# EAGLE design SnowFlake (EAGLE 8.5.1)
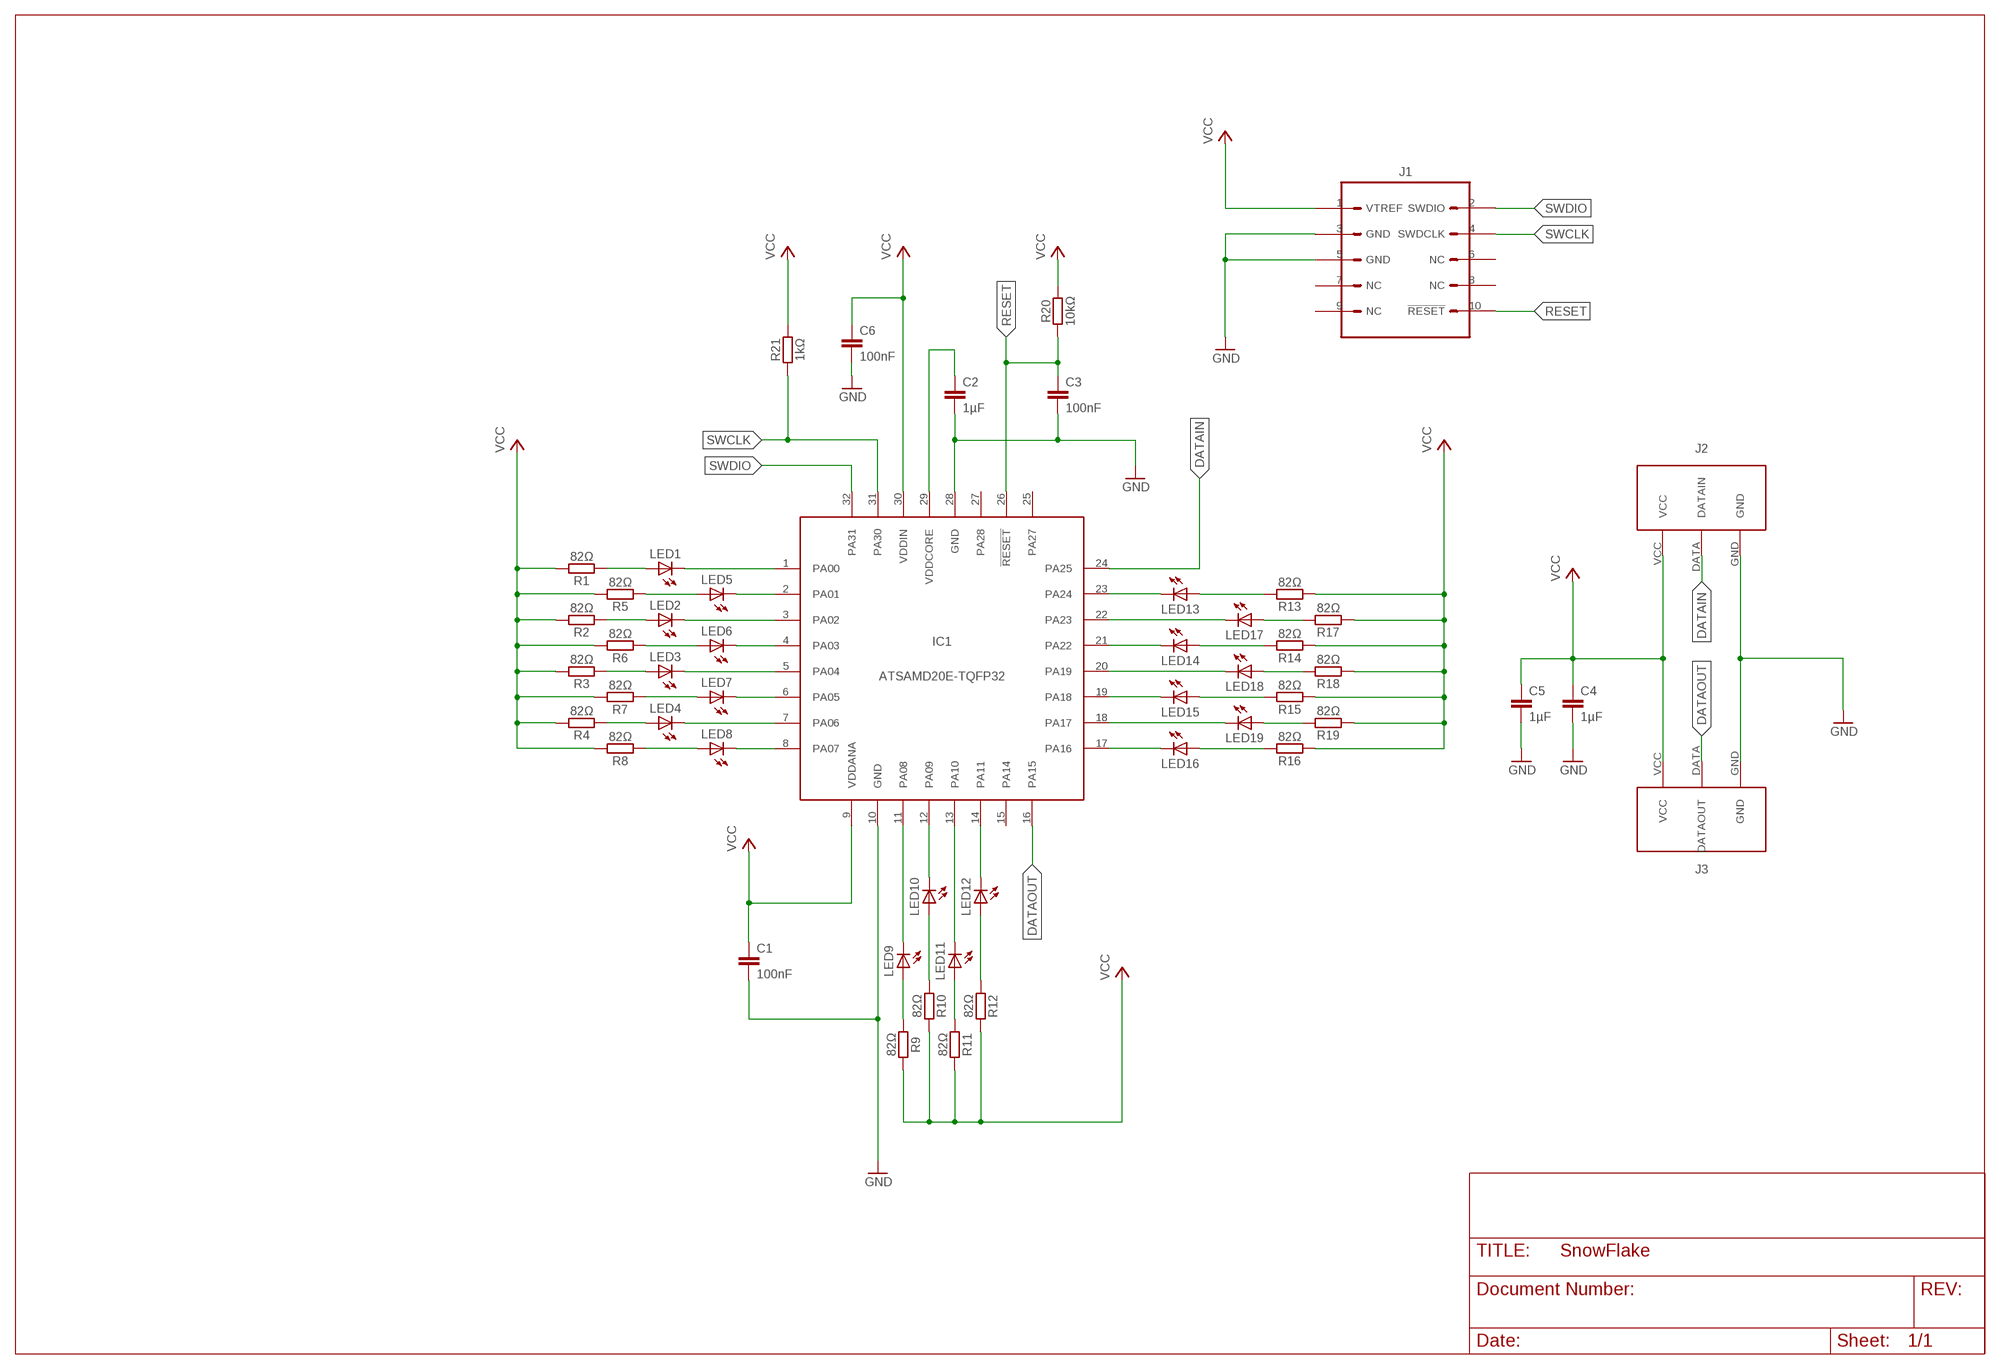
[diagram p0: schematic, sheet 1]

## Parts
C1  100nF  C0805-MURATA-GRM-21  [CAPACITOR-0805-MURATA-GRM-21]
C2  1µF  C0805-MURATA-GRM-21  [CAPACITOR-0805-MURATA-GRM-21]
C3  100nF  C0805-MURATA-GRM-21  [CAPACITOR-0805-MURATA-GRM-21]
C4  1µF  C0805-MURATA-GRM-21  [CAPACITOR-0805-MURATA-GRM-21]
C5  1µF  C0805-MURATA-GRM-21  [CAPACITOR-0805-MURATA-GRM-21]
C6  100nF  C0805-MURATA-GRM-21  [CAPACITOR-0805-MURATA-GRM-21]
IC1  ATSAMD20E-TQFP32  [TQFP32-08]
J1  CON-CORTEX-DEBUG-SMD1.27  [CON-2X5-HARWIN-1.27]
J2  CON-SNOWF-IN  [CON-PADS-3XWIRE-B]
J3  CON-SNOWF-OUT  [CON-PADS-3XWIRE-T]
LED1  LED0402  [LED-0402-ROHM]
LED2  LED0402  [LED-0402-ROHM]
LED3  LED0402  [LED-0402-ROHM]
LED4  LED0402  [LED-0402-ROHM]
LED5  LED0402  [LED-0402-ROHM]
LED6  LED0402  [LED-0402-ROHM]
LED7  LED0402  [LED-0402-ROHM]
LED8  LED0402  [LED-0402-ROHM]
LED9  LED0402  [LED-0402-ROHM]
LED10  LED0402  [LED-0402-ROHM]
LED11  LED0402  [LED-0402-ROHM]
LED12  LED0402  [LED-0402-ROHM]
LED13  LED0402  [LED-0402-ROHM]
LED14  LED0402  [LED-0402-ROHM]
LED15  LED0402  [LED-0402-ROHM]
LED16  LED0402  [LED-0402-ROHM]
LED17  LED0402  [LED-0402-ROHM]
LED18  LED0402  [LED-0402-ROHM]
LED19  LED0402  [LED-0402-ROHM]
R1  82Ω  RESISTOR0805-KOA-RK73-2A  [RESISTOR-0805-KOA-RK73-2A]
R2  82Ω  RESISTOR0805-KOA-RK73-2A  [RESISTOR-0805-KOA-RK73-2A]
R3  82Ω  RESISTOR0805-KOA-RK73-2A  [RESISTOR-0805-KOA-RK73-2A]
R4  82Ω  RESISTOR0805-KOA-RK73-2A  [RESISTOR-0805-KOA-RK73-2A]
R5  82Ω  RESISTOR0805-KOA-RK73-2A  [RESISTOR-0805-KOA-RK73-2A]
R6  82Ω  RESISTOR0805-KOA-RK73-2A  [RESISTOR-0805-KOA-RK73-2A]
R7  82Ω  RESISTOR0805-KOA-RK73-2A  [RESISTOR-0805-KOA-RK73-2A]
R8  82Ω  RESISTOR0805-KOA-RK73-2A  [RESISTOR-0805-KOA-RK73-2A]
R9  82Ω  RESISTOR0805-KOA-RK73-2A  [RESISTOR-0805-KOA-RK73-2A]
R10  82Ω  RESISTOR0805-KOA-RK73-2A  [RESISTOR-0805-KOA-RK73-2A]
R11  82Ω  RESISTOR0805-KOA-RK73-2A  [RESISTOR-0805-KOA-RK73-2A]
R12  82Ω  RESISTOR0805-KOA-RK73-2A  [RESISTOR-0805-KOA-RK73-2A]
R13  82Ω  RESISTOR0805-KOA-RK73-2A  [RESISTOR-0805-KOA-RK73-2A]
R14  82Ω  RESISTOR0805-KOA-RK73-2A  [RESISTOR-0805-KOA-RK73-2A]
R15  82Ω  RESISTOR0805-KOA-RK73-2A  [RESISTOR-0805-KOA-RK73-2A]
R16  82Ω  RESISTOR0805-KOA-RK73-2A  [RESISTOR-0805-KOA-RK73-2A]
R17  82Ω  RESISTOR0805-KOA-RK73-2A  [RESISTOR-0805-KOA-RK73-2A]
R18  82Ω  RESISTOR0805-KOA-RK73-2A  [RESISTOR-0805-KOA-RK73-2A]
R19  82Ω  RESISTOR0805-KOA-RK73-2A  [RESISTOR-0805-KOA-RK73-2A]
R20  10kΩ  RESISTOR0805-KOA-RK73-2A  [RESISTOR-0805-KOA-RK73-2A]
R21  1kΩ  RESISTOR0805-KOA-RK73-2A  [RESISTOR-0805-KOA-RK73-2A]

## Nets
DATAIN: IC1.24(PA25) J2.DATA(DATAIN)
DATAOUT: IC1.16(PA15) J3.DATA(DATAOUT)
GND: C1.2 C2.2 C3.2 C4.2 C5.2 C6.2 IC1.10(GND) IC1.28(GND) J1.3(GND) J1.5(GND) J2.GND J3.GND
LED1P: LED1.A R1.1
LED1S: IC1.1(PA00) LED1.C
LED2P: LED2.A R2.1
LED2S: IC1.3(PA02) LED2.C
LED3P: LED3.A R3.1
LED3S: IC1.5(PA04) LED3.C
LED4P: LED4.A R4.1
LED4S: IC1.7(PA06) LED4.C
LED5P: LED5.A R5.1
LED5S: IC1.2(PA01) LED5.C
LED6P: LED6.A R6.1
LED6S: IC1.4(PA03) LED6.C
LED7P: LED7.A R7.1
LED7S: IC1.6(PA05) LED7.C
LED8P: LED8.A R8.1
LED8S: IC1.8(PA07) LED8.C
LED9P: LED9.A R9.1
LED9S: IC1.11(PA08) LED9.C
LED10P: LED10.A R10.1
LED10S: IC1.12(PA09) LED10.C
LED11P: LED11.A R11.1
LED11S: IC1.13(PA10) LED11.C
LED12P: LED12.A R12.1
LED12S: IC1.14(PA11) LED12.C
LED13P: LED13.A R13.2
LED13S: IC1.23(PA24) LED13.C
LED14P: LED14.A R14.2
LED14S: IC1.21(PA22) LED14.C
LED15P: LED15.A R15.2
LED15S: IC1.19(PA18) LED15.C
LED16P: LED16.A R16.2
LED16S: IC1.17(PA16) LED16.C
LED17P: LED17.A R17.2
LED17S: IC1.22(PA23) LED17.C
LED18P: LED18.A R18.2
LED18S: IC1.20(PA19) LED18.C
LED19P: LED19.A R19.2
LED19S: IC1.18(PA17) LED19.C
RESET: C3.1 IC1.26(!RESET) J1.10(!RESET) R20.1
SWCLK: IC1.31(PA30) J1.4(SWDCLK) R21.1
SWDIO: IC1.32(PA31) J1.2(SWDIO)
VCC: C1.1 C4.1 C5.1 C6.1 IC1.9(VDDANA) IC1.30(VDDIN) J1.1(VTREF) J2.VCC J3.VCC R1.2 R2.2 R3.2 R4.2 R5.2 R6.2 R7.2 R8.2 R9.2 R10.2 R11.2 R12.2 R13.1 R14.1 R15.1 R16.1 R17.1 R18.1 R19.1 R20.2 R21.2
VDDCORE: C2.1 IC1.29(VDDCORE)
Unconnected: IC1.15(PA14) IC1.25(PA27) IC1.27(PA28) J1.6(NC) J1.7(NC) J1.8(NC) J1.9(NC)

## Library data of the parts
C1-C6 = lucky-resistor:C
IC1 = lucky-resistor:ATSAMD20E
J1 = lucky-resistor:CON-CORTEX-DEBUG
J2 = lucky-resistor:CON-SNOWF-IN
J3 = lucky-resistor:CON-SNOWF-OUT
LED1-LED19 = lucky-resistor:LED
R1-R21 = lucky-resistor:RESISTOR

## Board
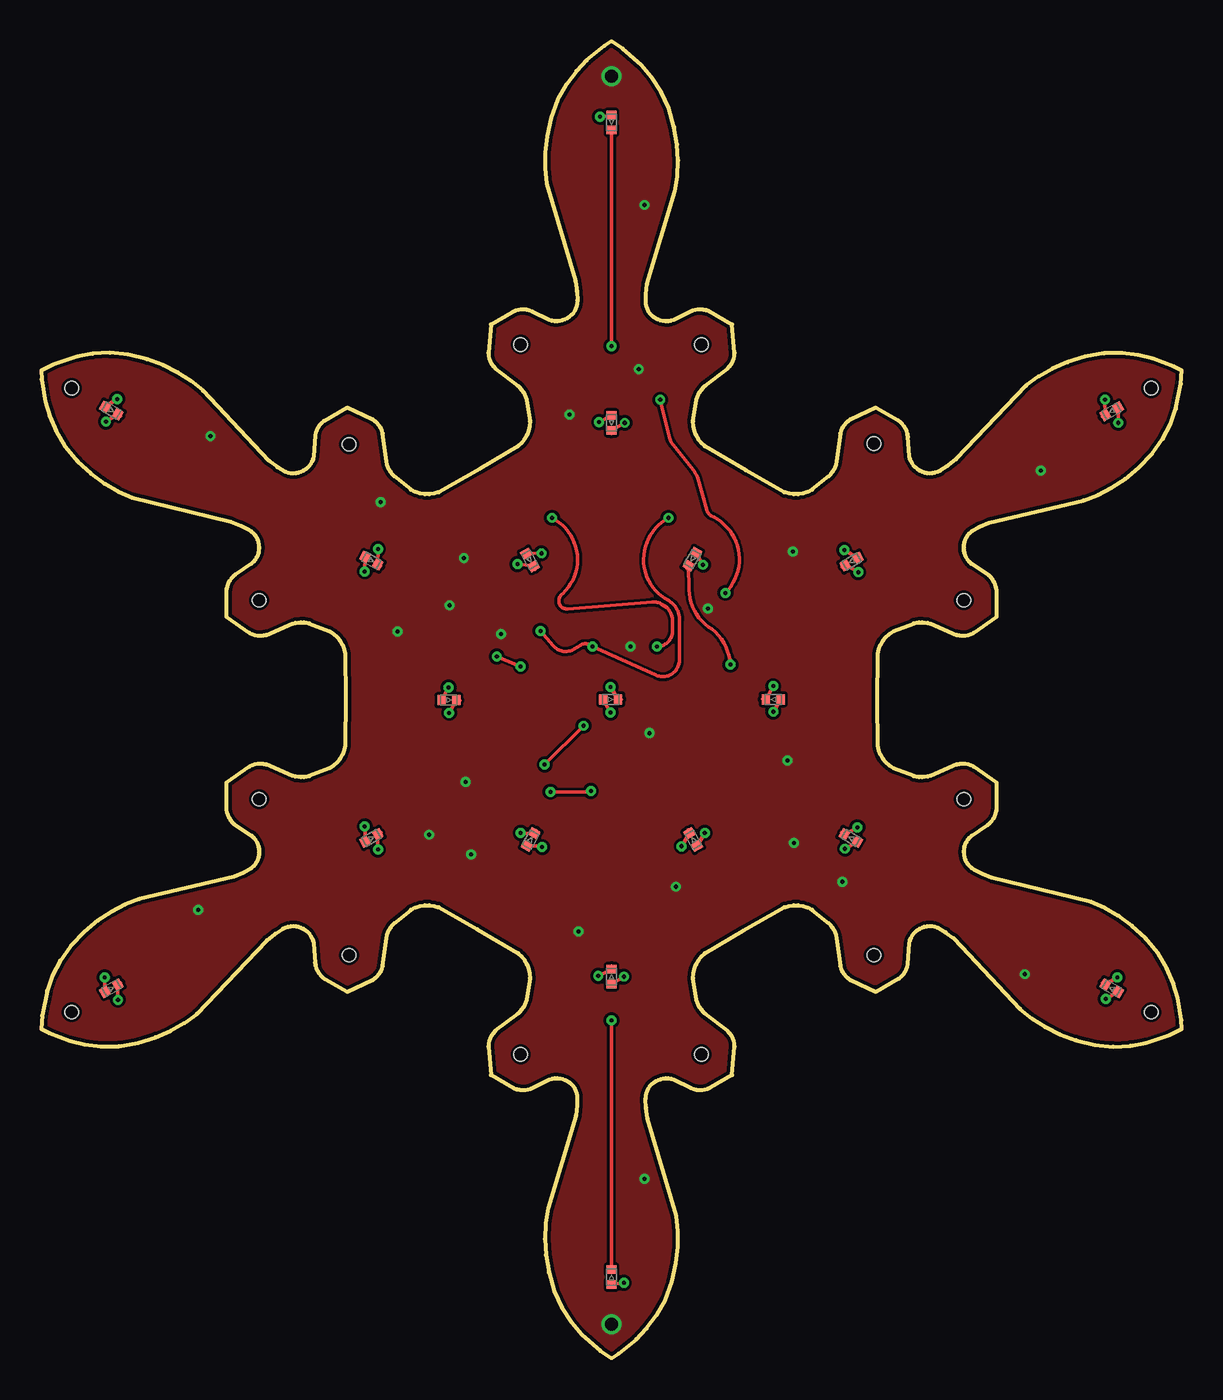
[diagram p1: board, top side]
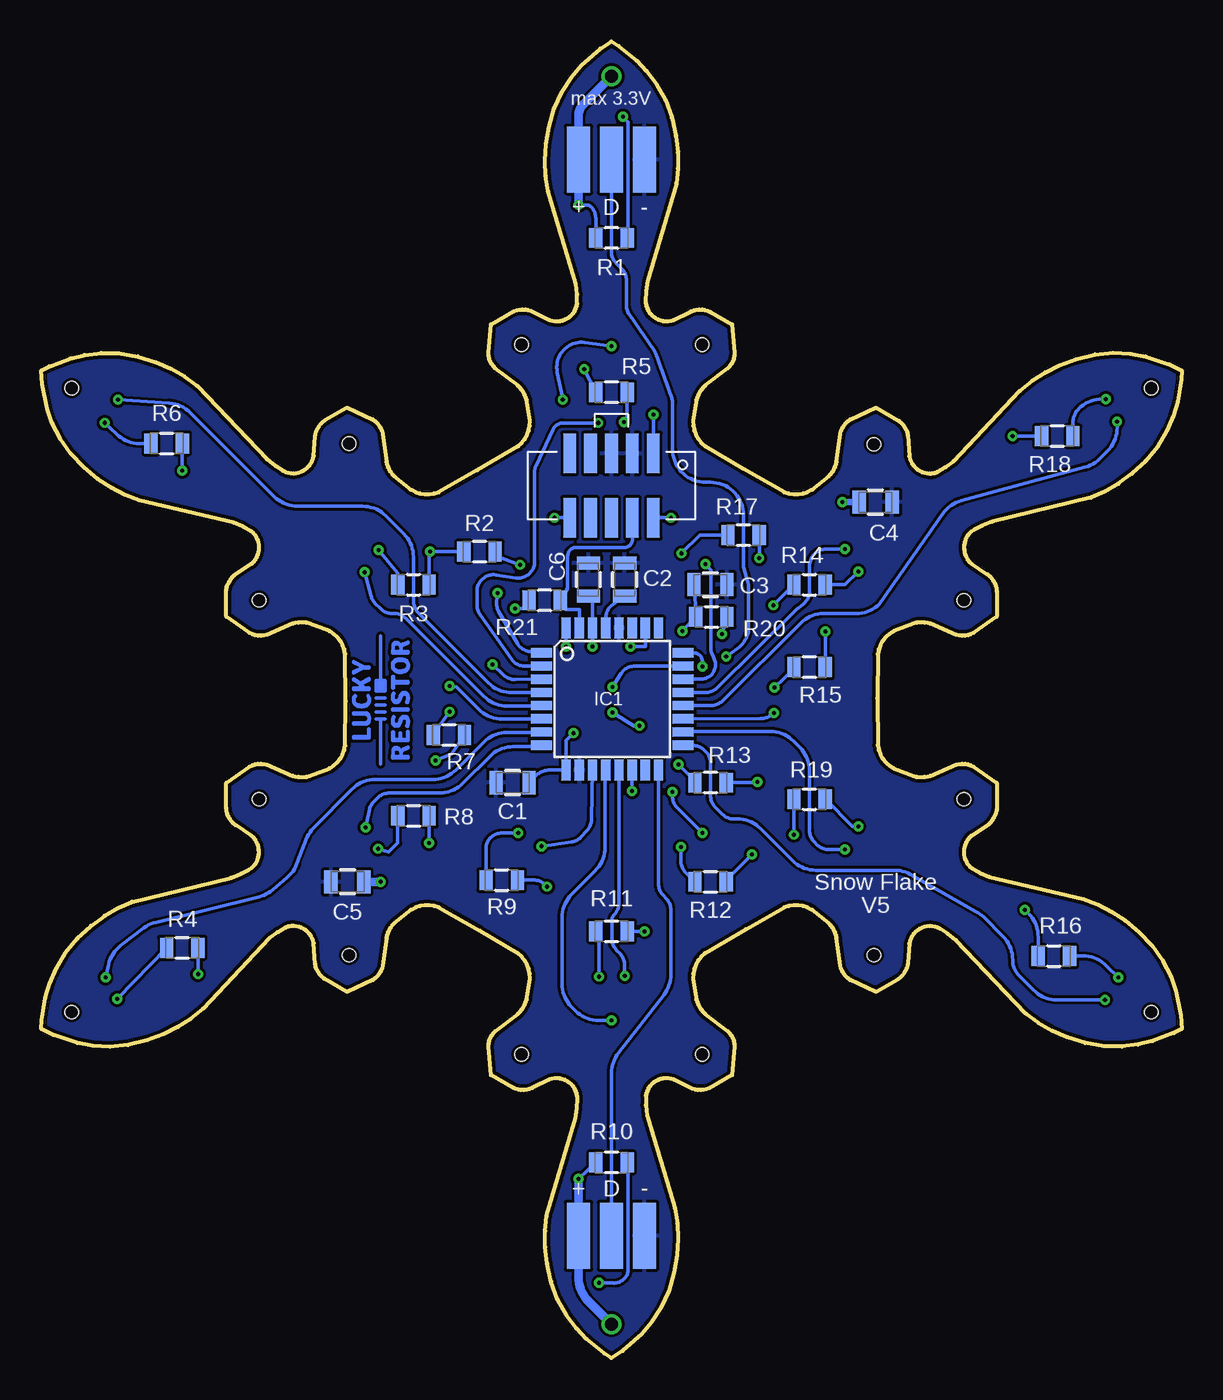
[diagram p2: board, bottom side, seen from below]

Size 69.09 x 79.78 mm. Coordinates in mm from the lower left corner, seen from the top.
Outline: 702 segments
Copper layers (1*16): Top 0.018mm / dielectric 1.55mm / Bottom 0.018mm
Design rules "eC_2Layer_PClass5_BaseCopperO18 *": minimum track width 0.175mm, minimum drill 0.25mm, track to track 0.176mm, track to pad 0.176mm, pad to pad 0.176mm, via to via 0.176mm, smd to smd 0mil, copper to edge 0.2mm, drill to drill 0.35mm, minimum pad ring 0.2mm, minimum via ring 0.15mm, stop-mask expansion 0mil, vias tented up to drill 0.45mm, thermal gap 0.2mm
Holes 0.8 mm at 67.25,58.77 67.25,20.97 1.85,20.97 1.85,58.77 50.45,55.42 40,61.42 55.9,45.92 29.05,61.42 55.9,33.87 50.45,24.42 40,18.42 29.05,18.42 18.65,24.42 13.2,33.87 13.2,45.92 18.65,55.37

### Footprints (pad centres in the part's own frame; a part is rotated, then mirrored left to right if it is on the bottom)
CAPACITOR-0805-MURATA-GRM-21 = smd 0.8 x 1.4: 1 -1,0; 2 1,0
TQFP32-08 = smd 1.27 x 0.559: 1 -4.293,2.8; 2 -4.293,2; 3 -4.293,1.2; 4 -4.293,0.4; 5 -4.293,-0.4; 6 -4.293,-1.2; 7 -4.293,-2; 8 -4.293,-2.8; 17 4.293,-2.8; 18 4.293,-2; 19 4.293,-1.2; 20 4.293,-0.4; 21 4.293,0.4; 22 4.293,1.2; 23 4.293,2; 24 4.293,2.8 | smd 0.559 x 1.27: 9 -2.8,-4.293; 10 -2,-4.293; 11 -1.2,-4.293; 12 -0.4,-4.293; 13 0.4,-4.293; 14 1.2,-4.293; 15 2,-4.293; 16 2.8,-4.293; 25 2.8,4.293; 26 2,4.293; 27 1.2,4.293; 28 0.4,4.293; 29 -0.4,4.293; 30 -1.2,4.293; 31 -2,4.293; 32 -2.8,4.293
CON-2X5-HARWIN-1.27 = smd 0.76 x 2.4: 1 -2.54,-1.95; 2 -2.54,1.95; 3 -1.27,-1.95; 4 -1.27,1.95; 5 0,-1.95; 6 0,1.95; 7 1.27,-1.95; 8 1.27,1.95; 9 2.54,-1.95; 10 2.54,1.95
CON-PADS-3XWIRE-B = smd 1.4 x 4: DATA 0,0; GND 2,0; VCC -2,0
CON-PADS-3XWIRE-T = smd 1.4 x 4: DATA 0,0; GND 2,0; VCC -2,0
LED-0402-ROHM = smd 0.5 x 0.6: A -0.45,0; C 0.45,0
RESISTOR-0805-KOA-RK73-2A = smd 0.8 x 1.2: 1 -0.95,0; 2 0.95,0

### Placement (x,y rotation side)
C1  40.55,34.87 180 bottom
C2  33.75,47.17 90 bottom
C3  28.55,46.87 0 bottom
C4  18.55,51.87 0 bottom
C5  50.55,28.87 180 bottom
C6  35.95,47.17 90 bottom
IC1  34.5,39.94 0 bottom
J1  34.55,52.87 180 bottom
J2  34.55,72.62 0 bottom
J3  34.55,7.42 0 bottom
LED1  34.55,74.87 270 top
LED2  39.45,48.42 240 top
LED3  49.1,48.27 210 top
LED4  64.85,22.42 150 top
LED5  34.55,56.67 270 top
LED6  64.85,57.37 210 top
LED7  44.35,39.92 180 top
LED8  49.05,31.52 150 top
LED9  39.5,31.42 120 top
LED10  34.55,4.92 90 top
LED11  34.55,23.12 90 top
LED12  29.65,31.42 60 top
LED13  34.5,39.92 0 top
LED14  20,48.32 330 top
LED15  24.7,39.87 0 top
LED16  4.25,22.42 30 top
LED17  29.6,48.37 300 top
LED18  4.25,57.42 330 top
LED19  20,31.52 30 top
R1  34.55,67.87 180 bottom
R2  42.55,48.87 180 bottom
R3  46.55,46.87 0 bottom
R4  60.55,24.87 0 bottom
R5  34.55,58.52 180 bottom
R6  61.5,55.42 0 bottom
R7  44.4,37.77 0 bottom
R8  46.55,32.87 0 bottom
R9  41.2,28.97 0 bottom
R10  34.55,11.87 180 bottom
R11  34.55,25.87 0 bottom
R12  28.55,28.87 0 bottom
R13  28.55,34.87 180 bottom
R14  22.55,46.87 0 bottom
R15  22.55,41.87 180 bottom
R16  7.75,24.37 0 bottom
R17  26.55,49.87 180 bottom
R18  7.55,55.87 0 bottom
R19  22.55,33.87 0 bottom
R20  28.5,44.92 0 bottom
R21  38.6,45.92 180 bottom
U$1  [LR_LOGO_COPPER_8MM]  48.55,39.87 90 bottom

### Tracks (layer width: path | path; a pad name or v marks a point on that pad's centre or on a via)
DATAIN  (via drill 0.25 pad 0.6)
  Top 0.2: v29.05,41.92 v27.6,42.52
  Bottom 0.2: J2.DATA 34.55,67.03 arc-45 34.25,66.32 33.94,66.01 arc45 33.65,65.3 33.65,63.79 arc-35 33.47,63.22 31.97,61.07 arc15 31.85,60.84 30.91,58.23 arc20 30.85,57.89 30.85,55.07 arc-90 28.85,53.07 28.55,53.07 arc90 26.55,51.07 26.55,47.98 arc-17 26.53,47.84 26.3,47.08 arc19 26.25,46.76 26.25,44.16 arc52 26.92,43.01 v27.6,42.52 | v29.05,41.92 29.05,42.22 arc-89 29.54,42.72 IC1.24
DATAOUT
  Bottom 0.2: J3.DATA 34.55,17.28 arc38 34.12,18.51 31.37,22.02 arc-38 30.95,23.26 30.95,27.15 arc-45 31.24,27.86 31.4,28.02 arc45 31.7,28.73 IC1.16
GND
  pour Bottom: 727 corners
LED1P  (via drill 0.25 pad 0.6)
  Top 0.2: v33.85,75.22 LED1.A
  Bottom 0.2: R1.1 33.55,68.08 33.55,74.87 v33.85,75.22
LED1S  (via drill 0.25 pad 0.6)
  Top 0.2: LED1.C v34.55,61.32 | v41.45,46.37 arc45 42.3,48.47 arc60 40.75,50.97 40.62,51.02 arc-51 40.33,51.34 39.78,53.28 arc23 39.51,53.8 38.31,55.3 arc-25 38.02,55.89 v37.5,58.07
  Bottom 0.2: v34.55,61.32 36.16,61.53 arc-109 37.84,59.75 v37.5,58.07 | 38.82,42.77 IC1.1 39.5,42.81 arc54 40.25,43.3 41.38,45.23 arc37 41.51,45.85 v41.45,46.37
LED2P  (via drill 0.25 pad 0.6)
  Top 0.2: LED2.A v40.1,48.07
  Bottom 0.2: v40.1,48.07 41.2,48.47 R2.1
LED2S  (via drill 0.25 pad 0.6)
  Top 0.2: LED2.C 39.25,46.57 arc59 40.65,44.17 arc-46 v41.75,42.02
  Bottom 0.2: v41.75,42.02 41.09,41.39 arc-44 40.39,41.12 IC1.3
LED3P  (via drill 0.25 pad 0.6)
  Top 0.2: v48.65,48.97 LED3.A
  Bottom 0.2: R3.1 47.5,47.57 v48.65,48.97
LED3S  (via drill 0.25 pad 0.6)
  Top 0.2: LED3.C v49.5,47.62
  Bottom 0.2: v49.5,47.62 49.12,46.18 arc-30 48.86,45.72 48.54,45.41 arc-45 47.83,45.12 47.71,45.12 arc45 47,44.82 42.28,40.1 arc-45 40.87,39.52 38.81,39.52 IC1.5
LED4P  (via drill 0.25 pad 0.6)
  Top 0.2: LED4.A v64.5,21.77
  Bottom 0.2: R4.1 v64.5,21.77
LED4S  (via drill 0.25 pad 0.6)
  Top 0.2: LED4.C v65.2,23.07
  Bottom 0.2: v65.2,23.07 65.01,23.86 arc40 64.27,25 62.88,26.06 arc23 62.14,26.41 55.9,27.95 arc-26 55.09,28.37 54.19,29.13 arc-29 53.61,29.94 53.05,31.43 arc24 52.6,32.11 50.29,34.47 arc45 48.86,35.07 45.38,35.07 arc-45 43.96,35.65 42.28,37.33 arc45 40.87,37.92 38.81,37.92 IC1.7
LED5P  (via drill 0.25 pad 0.6)
  Top 0.2: LED5.A v33.8,56.72
  Bottom 0.2: R5.1 33.6,56.92 v33.8,56.72
LED5S  (via drill 0.25 pad 0.6)
  Top 0.2: LED5.C v35.35,56.67
  Bottom 0.2: 38.81,41.92 IC1.2 39.77,41.92 arc56 40.6,42.35 42.51,45.06 arc35 42.7,45.63 42.7,46.46 arc98 41.56,47.45 40.34,47.28 arc-98 39.2,48.27 39.2,53.76 arc25 39.13,54.06 38.09,56.26 arc65 37.45,56.67 v35.35,56.67
LED6P  (via drill 0.25 pad 0.6)
  Top 0.2: v65.25,56.67 LED6.A
  Bottom 0.2: R6.1 63.14,55.42 arc44 64.53,55.97 v65.25,56.67
LED6S  (via drill 0.25 pad 0.6)
  Top 0.2: LED6.C v64.45,58.07
  Bottom 0.2: v64.45,58.07 61.35,57.86 arc41 60.06,57.28 54.98,52.2 arc-45 53.57,51.62 49.63,51.62 arc45 48.21,51.03 47.13,49.95 arc45 46.55,48.54 46.55,45.88 arc-45 46.25,45.17 41.98,40.9 arc-45 40.57,40.32 38.81,40.32 IC1.4
LED7P  (via drill 0.25 pad 0.6)
  Top 0.2: LED7.A v44.35,39.17
  Bottom 0.2: v44.35,39.17 R7.1
LED7S  (via drill 0.25 pad 0.6)
  Top 0.2: LED7.C v44.35,40.72
  Bottom 0.2: v44.35,40.72 43.95,40.67 42.58,39.3 arc-45 41.17,38.72 38.81,38.72 IC1.6
LED8P  (via drill 0.25 pad 0.6)
  Top 0.2: LED8.A v48.7,30.87
  Bottom 0.2: v48.7,30.87 48.05,30.67 47.5,31.22 R8.1
LED8S  (via drill 0.25 pad 0.6)
  Top 0.2: LED8.C v49.45,32.17
  Bottom 0.2: v49.45,32.17 49.21,33.23 arc32 48.94,33.72 48.72,33.95 arc45 48.01,34.24 44.97,34.24 arc-45 43.56,34.83 41.92,36.46 arc45 40.5,37.05 38.88,37.05 IC1.8
LED9P  (via drill 0.25 pad 0.6)
  Top 0.2: LED9.A v40.2,31.82
  Bottom 0.2: R9.1 42.15,30.9 arc45 41.89,31.52 arc45 41.18,31.82 v40.2,31.82
LED9S  (via drill 0.25 pad 0.6)
  Top 0.2: LED9.C v38.8,31.02
  Bottom 0.2: v38.8,31.02 36.98,31.27 arc-37 36.41,31.55 36.04,31.97 arc-45 35.75,32.68 IC1.11
LED10P  (via drill 0.25 pad 0.6)
  Top 0.2: LED10.A v35.3,4.57
  Bottom 0.2: v35.3,4.57 34.55,4.57 arc-90 33.55,5.27 33.55,11.8 R10.1
LED10S  (via drill 0.25 pad 0.6)
  Top 0.2: LED10.C v34.55,20.47
  Bottom 0.2: v34.55,20.47 35.32,20.47 arc45 36.73,21.05 36.96,21.28 arc45 37.55,22.69 37.55,26.69 arc45 36.96,28.1 35.53,29.53 arc-45 34.95,30.94 34.95,35.59 IC1.12
LED11P  (via drill 0.25 pad 0.6)
  Top 0.2: LED11.A v35.3,23.12
  Bottom 0.2: v35.3,23.12 35.3,25.67 R11.1
LED11S  (via drill 0.25 pad 0.6)
  Top 0.2: v33.75,23.17 LED11.C
  Bottom 0.2: v33.75,23.17 33.75,23.81 arc-45 34.04,24.52 34.23,24.71 arc45 34.52,25.42 34.52,26.54 arc45 34.39,26.86 arc-45 34.1,27.57 IC1.13
LED12P  (via drill 0.25 pad 0.6)
  Top 0.2: LED12.A 30.29,31.03 v30.35,30.97
  Bottom 0.2: v30.35,30.97 30.35,30.13 arc-45 30.05,29.42 R12.1
LED12S  (via drill 0.25 pad 0.6)
  Top 0.2: LED12.C v29.06,31.81 v29.05,31.82 | v30.85,34.32 33.25,34.32 v33.3,34.37
  Bottom 0.2: v29.05,31.82 30.55,33.32 arc45 30.85,34.03 v30.85,34.32 | v33.3,34.37 IC1.14
LED13P  (via drill 0.25 pad 0.6)
  Top 0.2: v30.5,35.97 v32.85,38.32 | v34.5,39.12 LED13.A
  Bottom 0.2: R13.2 29.5,34.97 v30.5,35.97 | v32.85,38.32 33.2,38.32 v34.5,39.12
LED13S  (via drill 0.25 pad 0.6)
  Top 0.2: v34.5,40.67 LED13.C
  Bottom 0.2: IC1.23 33.13,41.94 arc-57 33.97,41.48 v34.5,40.67
LED14P  (via drill 0.25 pad 0.6)
  Top 0.2: LED14.A v19.6,47.67
  Bottom 0.2: R14.2 20.4,46.87 v19.6,47.67
LED14S  (via drill 0.25 pad 0.6)
  Top 0.2: LED14.C v20.4,49.02
  Bottom 0.2: v20.4,49.02 21.55,49.02 arc-90 22.55,48.02 22.55,46.47 arc54 22.96,45.67 23.24,45.46 arc-8 23.35,45.36 28.15,40.61 arc45 28.87,40.32 IC1.21 30.18,40.32
LED15P  (via drill 0.25 pad 0.6)
  Top 0.2: LED15.A v24.68,40.63
  Bottom 0.2: R15.2 23.5,41.77 v24.68,40.63
LED15S  (via drill 0.25 pad 0.6)
  Top 0.2: LED15.C v24.72,39.1
  Bottom 0.2: v24.72,39.1 24.8,39.01 arc45 25.51,38.77 30.18,38.72 IC1.19
LED16P  (via drill 0.25 pad 0.6)
  Top 0.2: LED16.A v3.86,23.06 v3.85,23.07
  Bottom 0.2: R16.2 5.98,24.37 arc45 4.56,23.78 v3.85,23.07
LED16S  (via drill 0.25 pad 0.6)
  Top 0.2: LED16.C v4.64,21.73 v4.65,21.72
  Bottom 0.2: v4.65,21.72 7.57,21.72 arc45 8.98,22.3 9.84,23.16 arc45 10.25,24.14 arc-45 10.83,25.55 12,26.72 arc-16 12.44,27.05 16.44,29.31 arc-29 17.42,29.57 22.17,29.57 arc45 23.58,30.15 25.51,32.08 arc-45 26.93,32.67 27.13,32.67 arc45 27.84,32.96 28.25,33.37 arc45 28.55,34.08 28.55,36.05 arc-45 28.84,36.76 28.9,36.82 arc-45 29.61,37.12 30.18,37.12 IC1.17
LED17P  (via drill 0.25 pad 0.6)
  Top 0.2: LED17.A v30.3,48.77
  Bottom 0.2: 27.5,49.77 R17.2 29.2,49.87 v30.3,48.77
LED17S  (via drill 0.25 pad 0.6)
  Top 0.2: LED17.C v28.85,48.12
  Bottom 0.2: v28.85,48.12 28.85,48.07 28.52,47.73 28.52,42.95 arc-23 28.48,42.75 28.37,42.47 arc113 29,41.15 IC1.22 30.18,41.12
LED18P  (via drill 0.25 pad 0.6)
  Top 0.2: LED18.A v4.6,58.12
  Bottom 0.2: R18.2 6.6,56.65 arc45 6.23,57.53 arc45 4.82,58.12 v4.6,58.12
LED18S  (via drill 0.25 pad 0.6)
  Top 0.2: LED18.C v3.92,56.74
  Bottom 0.2: v3.92,56.74 3.92,56.37 arc45 4.5,54.96 4.97,54.49 arc30 5.86,53.98 13.35,51.95 arc-40 14.46,51.17 18.25,45.77 18.31,45.7 arc45 19.73,45.12 21.72,45.12 arc-45 23.08,44.53 27.83,39.83 arc45 28.54,39.54 IC1.20
LED19P  (via drill 0.25 pad 0.6)
  Top 0.2: LED19.A v19.61,32.21 v19.6,32.22
  Bottom 0.2: v19.6,32.22 19.95,32.22 R19.2
LED19S  (via drill 0.25 pad 0.6)
  Top 0.2: LED19.C v20.39,30.83 v20.4,30.82
  Bottom 0.2: v20.4,30.82 21.38,30.82 arc45 22.09,31.11 22.25,31.27 arc45 22.55,31.98 22.55,35.59 arc-45 23.13,37 23.51,37.38 arc-45 24.93,37.97 30.17,37.97 IC1.18
RESET  (via drill 0.25 pad 0.6)
  Top 0.2: v38,50.92 arc60 36.5,48.42 arc60 37.75,46.07 38.02,45.89 arc-63 38.66,44.66 38.66,42.29 arc-114 37.25,41.38 v33.4,43.12 33.2,43.22 arc60 32.7,43.21 32.28,42.96 arc-81 31,43.17 v30.25,44.07
  Bottom 0.2: C3.1 29.5,46.82 R20.1 v30.25,44.07 | J1.10 v38,50.92 | v33.4,43.12 32.5,43.12 IC1.26
SWCLK
  Bottom 0.2: J1.4 33.28,49.62 arc90 33.78,49.12 36.7,49.12 arc-90 37.2,48.62 37.2,46.62 R21.1 37.3,45.37 36.5,45.37 IC1.31
SWDIO  (via drill 0.25 pad 0.6)
  Top 0.2: v30.95,50.92 arc-60 32.5,48.42 arc-45 31.6,46.32 31.53,46.25 arc83 31.44,45.6 arc64 31.88,45.4 37.03,45.81 arc-41 37.61,45.66 37.9,45.47 arc-50 38.25,44.67 38.25,44.07 arc-90 v37.3,43.12
  Bottom 0.2: J1.2 v30.95,50.92 | v37.3,43.12 IC1.32
VCC  (via drill 0.25 pad 0.6, 0.8)
  Bottom 0.2: v36.85,37.87 37.3,37.42 IC1.9 38.39,35.62 arc-44 39.08,35.33 C1.1 | R1.2 35.5,69.05 arc-45 35.79,69.76 arc-45 36.05,69.87 v36.55,69.87 | R17.1 v25.6,48.47 | R20.2 v27.85,43.87 | R13.1 25.75,34.87 v25.7,34.92 | R2.2 v45.55,48.87 45.6,48.82 R3.2 | R5.2 v36.2,59.92 | R6.2 v60.55,53.77 | R4.2 v59.6,23.27 | R8.2 v45.6,31.22 | R11.2 v32.55,25.87 | R12.2 27.6,28.97 v26.05,30.52 | R19.1 v23.5,31.72 | R16.1 8.7,25.54 arc-45 9.28,26.95 v9.5,27.17 | R15.1 v21.6,44.02 | R18.1 v10.25,55.87 | R14.1 v24.75,45.62 | R9.2 39.26,28.97 arc45 38.55,28.67 v38.45,28.57 | R10.2 v36.55,10.87 | J1.1 v32.01,57.16 v32,57.17 | C6.1 35.7,45.87 IC1.30 v35.7,43.12 | v40.4,45.42 39.8,45.42 R21.2 | v45.2,36.22 44.25,36.62 R7.2
  Bottom 0.4: C4.1 v20.55,51.87
  Bottom 0.5: v36.55,69.87 J2.VCC 36.55,75.25 arc45 36.25,75.96 v34.55,77.67 | v36.55,10.87 J3.VCC 36.55,4.89 arc-45 35.96,3.48 v34.55,2.07 | C5.1 v48.55,28.87
  pour Top (isolate 0.1): 727 corners
VDDCORE
  Bottom 0.2: IC1.29 34.9,44.84 arc55 34.47,45.66 C2.1

### Text on the board
bNames: max 3.3V | Snow Flake | V5